# Altium schematic sheet Sheet1.SchDoc
size A4; SheetNumber: 1; SheetTotal: 1
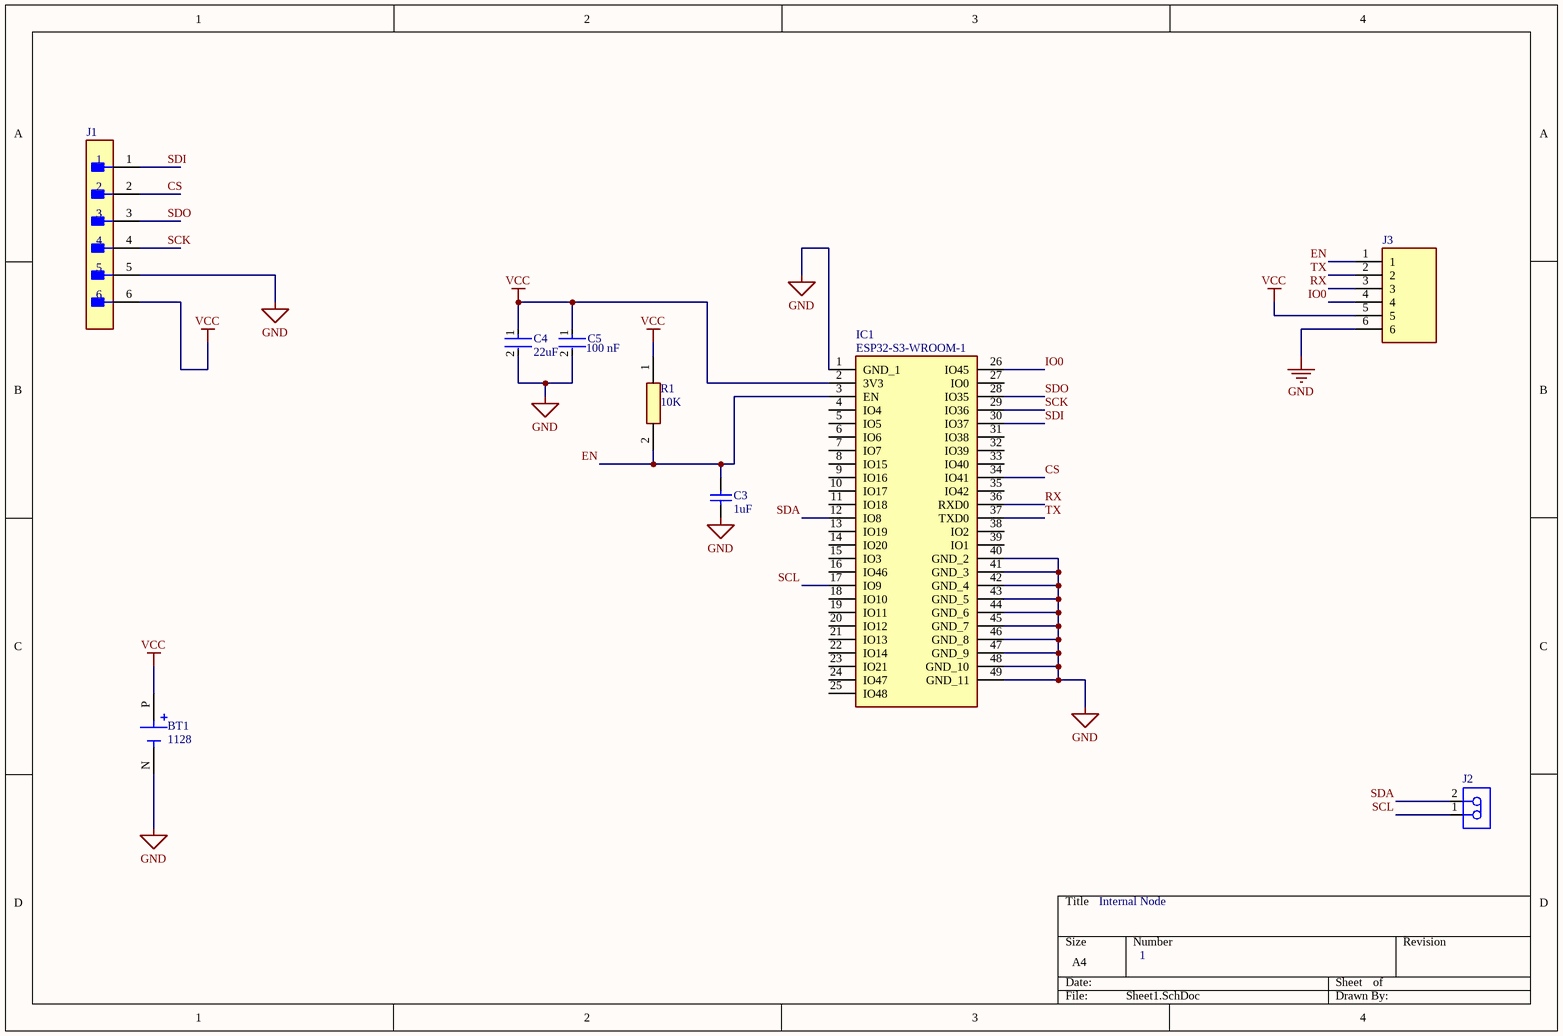
[diagram p0: Sheet1.SchDoc]

## Parts
BT1  1128  [BAT_1128]
C3  1uF  [CAPC2013X140X50LL20T25]
C4  22uF  [FP-CL21-IPC_C]
C5  Capacitance: 100 nF  [FP-CC0805-0_85-MFG]  (hidden comment: CC0805KRX7R7BB104)
IC1  ESP32-S3-WROOM-1  [ESP32S3WROOM1]
J1  B6B-PH-K-K(LF)(SN)  [FP-B6B-PH-K-K_LF_SN-MFG]  (value not drawn)
J2  B2B-PH-K-S(LF)(SN)  [JST-B2B-PH-K-S_V]  (value not drawn)
J3  22-28-4060  [HDRV6W66P0X254_1X6_1524X249X838P]  (value not drawn)
R1  10K  [RESC2012X60N]

## Nets
GND: BT1.N(NEG) C3.1 C4.2 C5.2 IC1.1(GND_1) IC1.40(GND_2) IC1.41(GND_3) IC1.42(GND_4) IC1.43(GND_5) IC1.44(GND_6) IC1.45(GND_7) IC1.46(GND_8) IC1.47(GND_9) IC1.48(GND_10) IC1.49(GND_11) J1.5 J3.6
VCC: BT1.P(POS) C4.1 C5.1 IC1.2(3V3) J1.6 J3.5 R1.1
CS: IC1.34(IO41) J1.2
EN: C3.2 IC1.3(EN) J3.1 R1.2
IO0: IC1.26(IO45) J3.4
RX: IC1.36(RXD0) J3.3
SCK: IC1.29(IO36) J1.4
SCL: IC1.17(IO9) J2.1
SDA: IC1.12(IO8) J2.2
SDI: IC1.30(IO37) J1.1
SDO: IC1.28(IO35) J1.3
TX: IC1.37(TXD0) J3.2

Not connected (* = marked no-connect by the designer): IC1 4(IO4) 5(IO5) 6(IO6) 7(IO7) 8(IO15) 9(IO16) 10(IO17) 11(IO18) 13(IO19) 14(IO20) 15(IO3) 16(IO46) 18(IO10) 19(IO11) 20(IO12) 21(IO13) 22(IO14) 23(IO21) 24(IO47) 25(IO48) 27(IO0) 31(IO38) 32(IO39) 33(IO40) 35(IO42) 38(IO2) 39(IO1)

## Notes on the sheet
- Internal Node
- 1

## Library data of the parts
BT1 = 1128: SMT Holder for CR123A Battery w/ coil spring; MF: Keystone Electronics; SnapEDA_Link: https://www.snapeda.com/parts/1128/Keystone+Electronics/view-part/?ref=snap; Price: None; Check_prices: https://www.snapeda.com/parts/1128/Keystone+Electronics/view-part/?ref=eda; Purchase-URL: https://pricing.snapeda.com/search/part/1128/?ref=eda; MP: 1128; Value: *; Availability: In Stock; Package: None
C3 = CMP-2007-04674-1: Part Number: 0805ZC105KAZ2A; Manufacturer: AVX Interconnect / Elco
C4 = CMP-13271-002990-1: CL21 Series 0805 22uF 16V ±20% Tolerance X5R Multilayer Ceramic Chip Capacitor; Case Code (Imperial): 0805; Capacitance: 22uF; Max Operating Temperature: 85°C; Min Operating Temperature: -55°C; Packaging: Tape and Reel; Case Code (Metric): 2012; Case/Package: 0805; Mount: Surface Mount; Tolerance: 20%; Thickness: 0.037inch; Voltage Rating: 16V; Width: 0.049inch; Length: 0.079inch
C5 = CMP-1036-04402-6: CAP CER 0.1UF 16V X7R 0805; Manufacturer: Yageo; Material: Ceramic; Tolerance: 0.1; Value: 100 nF; Manufacturer Part Number: CC0805KRX7R7BB104; Temperature: -30°C to +85°C; Lead Free: Yes; Footprint Url: http://www.yageo.com/exep/pages/download/literatures/UPY-C_GEN_24.pdf; Voltage Rating: 16 V; Package: CC0805-0.85; RoHS: TRUE; Digikey Description: CAP CER 0.1UF 16V X7R 0805; Category: Cap; Octopart: https://octopart.com/cc0805krx7r7bb104-yageo-39467769; Device Class L3: Ceramic Capacitors; ComponentLink2URL: http://www.yageo.com/documents/recent/UPY-GPHC_Y5V_6.3V-to-50V_8.pdf; Temperature Range Low: -30°C; Mouser Description: Multilayer Ceramic Capacitors MLCC - SMD/SMT 100nF 16V X7R 10%; Automotive: No; Device Class L2: Capacitors; Height: 0.95mm; ComponentLink2Description: Datasheet; Temperature Characteristic: X7R; Ipc Land Pattern Name: CAPC200125X85; Device Class L1: Passive Components; Temperature Range High: +85°C
IC1 = ESP32-S3-WROOM-1: Integrated Circuit; Manufacturer_Name: Espressif Systems; Datasheet Link: https://www.mouser.com/catalog/specsheets/Espressif_ESP32_S3_WROOM_1_1U_Preliminary.pdf; Height: 3.25mm; Manufacturer_Part_Number: ESP32-S3-WROOM-1
J1 = CMP-17439-000495-1: PH Series 6 Position 2 mm Pitch Through Hole Top Entry Shrouded Header; Lead Free: Lead Free
J2 = CMP-2000-05162-1: Male Header, Pitch 2 mm, 1 x 2 Position, Height 6 mm, Tail Length 3.4 mm, -25 to 85 degC, RoHS, Bulk; Manufacturer: JST; Pitch: 2mm; Style/Orientation: StraightHeader/Plug; No of Positions: 2; Datasheet Version: Nov-08; Datasheet URL: http://datasheet.octopart.com/B2B-PH-K-S%28LF%29%28SN%29-JST-datasheet-8324864.pdf; Manufacturer URL: http://www.jst.com/home2.html; Type: ShroudedHeader; Termination: Crimp
J3 = 22-28-4060: Connector; Manufacturer_Name: Molex; Datasheet Link: https://www.molex.com/pdm_docs/sd/022284060_sd.pdf; Height: 8.38mm; Manufacturer_Part_Number: 22-28-4060; Mouser Part Number: 538-22-28-4060; Mouser Price/Stock: https://www.mouser.co.uk/ProductDetail/Molex/22-28-4060?qs=d9fIA1aNikSACgwI0d%252BTOw%3D%3D
R1 = CMP0805AFX-1002ELF: Resistor; Manufacturer_Name: Bourns; Datasheet Link: https://ms.componentsearchengine.com/Datasheets/2/CMP0805AFX-1002ELF.pdf; Height: 0.6mm; Manufacturer_Part_Number: CMP0805AFX-1002ELF; Mouser Part Number: 652-CMP0805AFX-1002L; Mouser Price/Stock: https://www.mouser.co.uk/ProductDetail/Bourns/CMP0805AFX-1002ELF?qs=TiOZkKH1s2RdWJm6UffAxg%3D%3D; Arrow Part Number: CMP0805AFX-1002ELF; Arrow Price/Stock: https://www.arrow.com/en/products/cmp0805afx-1002elf/bourns?region=nac